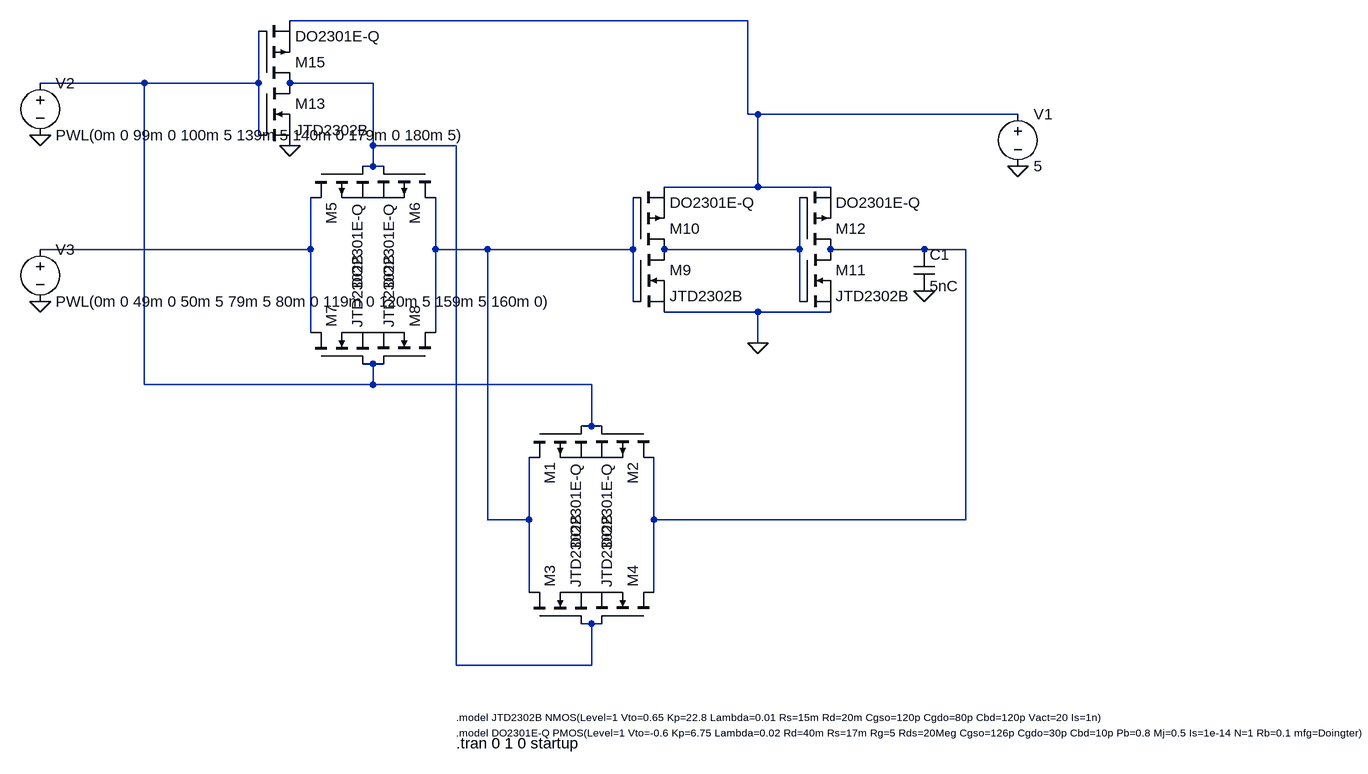
[diagram p0: schematic dlatch.asc]
dlatch.asc, the LTspice schematic file:
Version 4.1
SHEET 1 1856 680
WIRE 32 -800 -672 -800
WIRE -896 -704 -1056 -704
WIRE -720 -704 -720 -784
WIRE -720 -704 -896 -704
WIRE -544 -704 -672 -704
WIRE 32 -656 32 -800
WIRE 48 -656 32 -656
WIRE 448 -656 48 -656
WIRE -720 -624 -720 -704
WIRE -544 -608 -544 -704
WIRE -416 -608 -544 -608
WIRE -544 -576 -544 -608
WIRE -544 -576 -560 -576
WIRE -528 -576 -544 -576
WIRE 48 -544 48 -656
WIRE 48 -544 -96 -544
WIRE 160 -544 48 -544
WIRE -640 -448 -640 -528
WIRE -640 -448 -1056 -448
WIRE -448 -448 -448 -528
WIRE -368 -448 -448 -448
WIRE -144 -448 -144 -528
WIRE -144 -448 -368 -448
WIRE 112 -448 112 -528
WIRE 112 -448 -96 -448
WIRE 304 -448 160 -448
WIRE 368 -448 304 -448
WIRE -144 -368 -144 -448
WIRE 112 -368 112 -448
WIRE 48 -352 -96 -352
WIRE 160 -352 48 -352
WIRE -640 -320 -640 -448
WIRE -448 -320 -448 -448
WIRE 48 -304 48 -352
WIRE -544 -272 -560 -272
WIRE -528 -272 -544 -272
WIRE -896 -240 -896 -704
WIRE -544 -240 -544 -272
WIRE -544 -240 -896 -240
WIRE -208 -240 -544 -240
WIRE -208 -176 -208 -240
WIRE -208 -176 -224 -176
WIRE -192 -176 -208 -176
WIRE -368 -32 -368 -448
WIRE -304 -32 -304 -128
WIRE -304 -32 -368 -32
WIRE -112 -32 -112 -128
WIRE 368 -32 368 -448
WIRE 368 -32 -112 -32
WIRE -304 80 -304 -32
WIRE -112 80 -112 -32
WIRE -208 128 -224 128
WIRE -192 128 -208 128
WIRE -416 192 -416 -608
WIRE -208 192 -208 128
WIRE -208 192 -416 192
FLAG 48 -304 0
FLAG 448 -576 0
FLAG -672 -608 0
FLAG -1056 -368 0
FLAG -1056 -624 0
FLAG 304 -384 0
SYMBOL pmos -304 -176 M90
SYMATTR InstName M1
SYMATTR Value DO2301E-Q
SYMBOL pmos -112 -176 R90
SYMATTR InstName M2
SYMATTR Value DO2301E-Q
SYMBOL nmos -304 128 R270
SYMATTR InstName M3
SYMATTR Value JTD2302B
SYMBOL nmos -112 128 M270
SYMATTR InstName M4
SYMATTR Value JTD2302B
SYMBOL pmos -640 -576 M90
SYMATTR InstName M5
SYMATTR Value DO2301E-Q
SYMBOL pmos -448 -576 R90
SYMATTR InstName M6
SYMATTR Value DO2301E-Q
SYMBOL nmos -640 -272 R270
SYMATTR InstName M7
SYMATTR Value JTD2302B
SYMBOL nmos -448 -272 M270
SYMATTR InstName M8
SYMATTR Value JTD2302B
SYMBOL nmos -144 -448 R0
SYMATTR InstName M9
SYMATTR Value JTD2302B
SYMBOL pmos -144 -448 M180
SYMATTR InstName M10
SYMATTR Value DO2301E-Q
SYMBOL nmos 112 -448 R0
SYMATTR InstName M11
SYMATTR Value JTD2302B
SYMBOL pmos 112 -448 M180
SYMATTR InstName M12
SYMATTR Value DO2301E-Q
SYMBOL voltage 448 -672 R0
WINDOW 123 0 0 Left 0
WINDOW 39 0 0 Left 0
SYMATTR InstName V1
SYMATTR Value 5
SYMBOL nmos -720 -704 R0
SYMATTR InstName M13
SYMATTR Value JTD2302B
SYMBOL pmos -720 -704 M180
SYMATTR InstName M15
SYMATTR Value DO2301E-Q
SYMBOL voltage -1056 -720 R0
WINDOW 123 0 0 Left 0
WINDOW 39 0 0 Left 0
SYMATTR InstName V2
SYMATTR Value PWL(0m 0 99m 0 100m 5 139m 5 140m 0 179m 0 180m 5)
SYMBOL voltage -1056 -464 R0
WINDOW 123 0 0 Left 0
WINDOW 39 0 0 Left 0
SYMATTR InstName V3
SYMATTR Value PWL(0m 0 49m 0 50m 5 79m 5 80m 0 119m 0 120m 5 159m 5 160m 0)
SYMBOL cap 288 -448 R0
SYMATTR InstName C1
SYMATTR Value 5nC
TEXT -416 272 Left 1 !.model JTD2302B NMOS(Level=1 Vto=0.65 Kp=22.8 Lambda=0.01 Rs=15m Rd=20m Cgso=120p Cgdo=80p Cbd=120p Vact=20 Is=1n)
TEXT -416 296 Left 1 !.model DO2301E-Q PMOS(Level=1 Vto=-0.6 Kp=6.75 Lambda=0.02 Rd=40m Rs=17m Rg=5 Rds=20Meg Cgso=126p Cgdo=30p Cbd=10p Pb=0.8 Mj=0.5 Is=1e-14 N=1 Rb=0.1 mfg=Doingter)
TEXT -416 312 Left 2 !.tran 0 1 0 startup

The netlist it stands for:
* dlatch.asc
M1 N005 N002 P001 P001 DO2301E-Q
M2 N007 N002 P001 P001 DO2301E-Q
M3 N005 N003 P002 P002 JTD2302B
M4 N007 N003 P002 P002 JTD2302B
M5 N004 N003 P003 P003 DO2301E-Q
M6 N005 N003 P003 P003 DO2301E-Q
M7 N004 N002 P004 P004 JTD2302B
M8 N005 N002 P004 P004 JTD2302B
M9 N006 N005 0 0 JTD2302B
M10 N006 N005 N001 N001 DO2301E-Q
M11 N007 N006 0 0 JTD2302B
M12 N007 N006 N001 N001 DO2301E-Q
V1 N001 0 5
M13 N003 N002 0 0 JTD2302B
M15 N003 N002 N001 N001 DO2301E-Q
V2 N002 0 PWL(0m 0 99m 0 100m 5 139m 5 140m 0 179m 0 180m 5)
V3 N004 0 PWL(0m 0 49m 0 50m 5 79m 5 80m 0 119m 0 120m 5 159m 5 160m 0)
C1 N007 0 5nC
.model NMOS NMOS
.model PMOS PMOS
.lib standard.mos
.model JTD2302B NMOS(Level=1 Vto=0.65 Kp=22.8 Lambda=0.01 Rs=15m Rd=20m Cgso=120p Cgdo=80p Cbd=120p Vact=20 Is=1n)
.model DO2301E-Q PMOS(Level=1 Vto=-0.6 Kp=6.75 Lambda=0.02 Rd=40m Rs=17m Rg=5 Rds=20Meg Cgso=126p Cgdo=30p Cbd=10p Pb=0.8 Mj=0.5 Is=1e-14 N=1 Rb=0.1 mfg=Doingter)
.tran 0 1 0 startup
.backanno
.end